# Altium project Custom Phone.PrjPcb (part 2 of 4)

## Sheet Power.SchDoc
size C; SheetNumber: 3; SheetTotal: 9
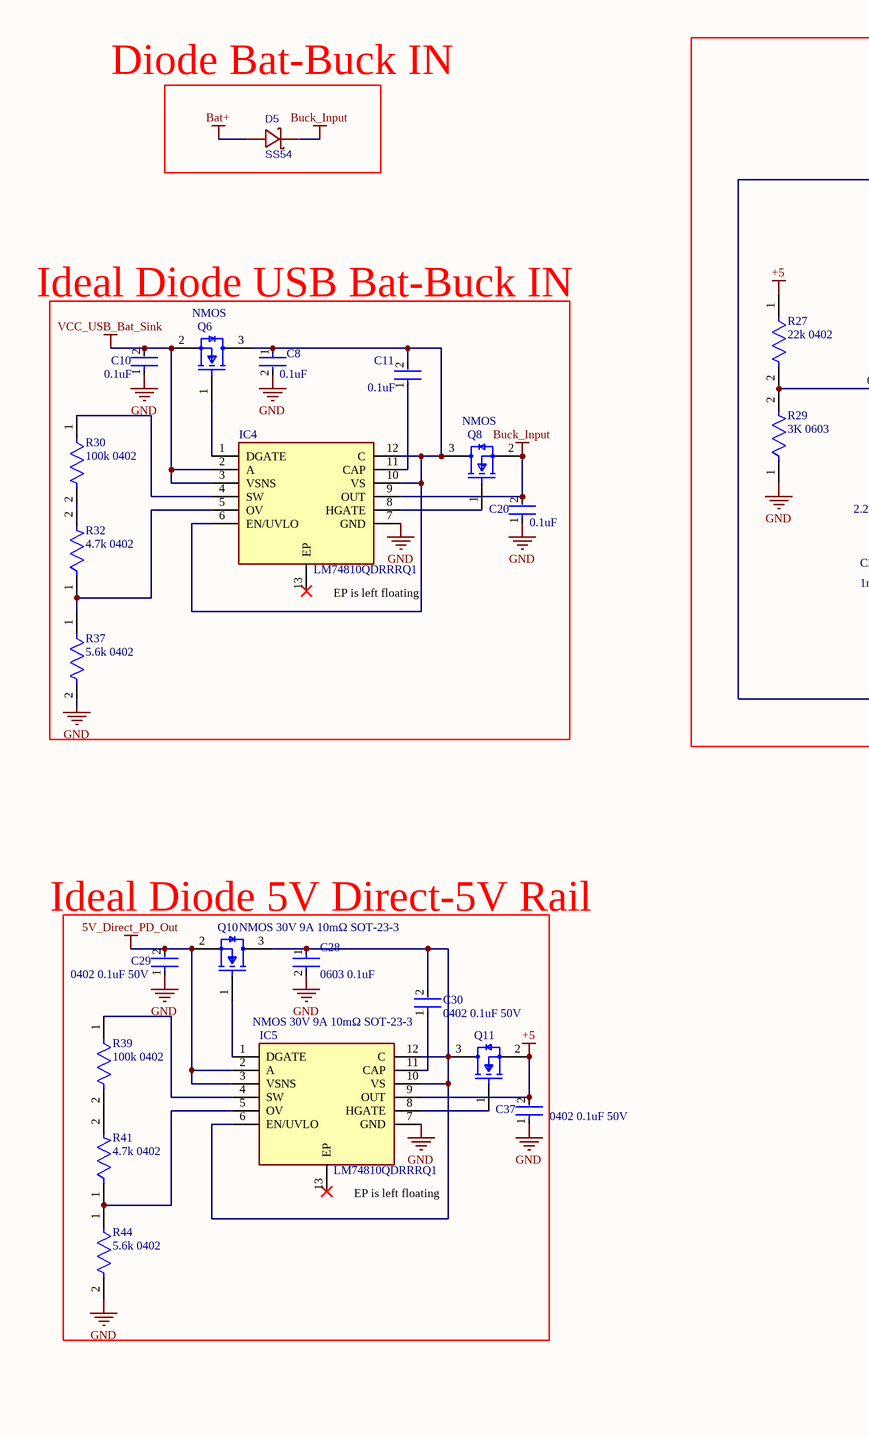
[diagram p5: Power.SchDoc, left]
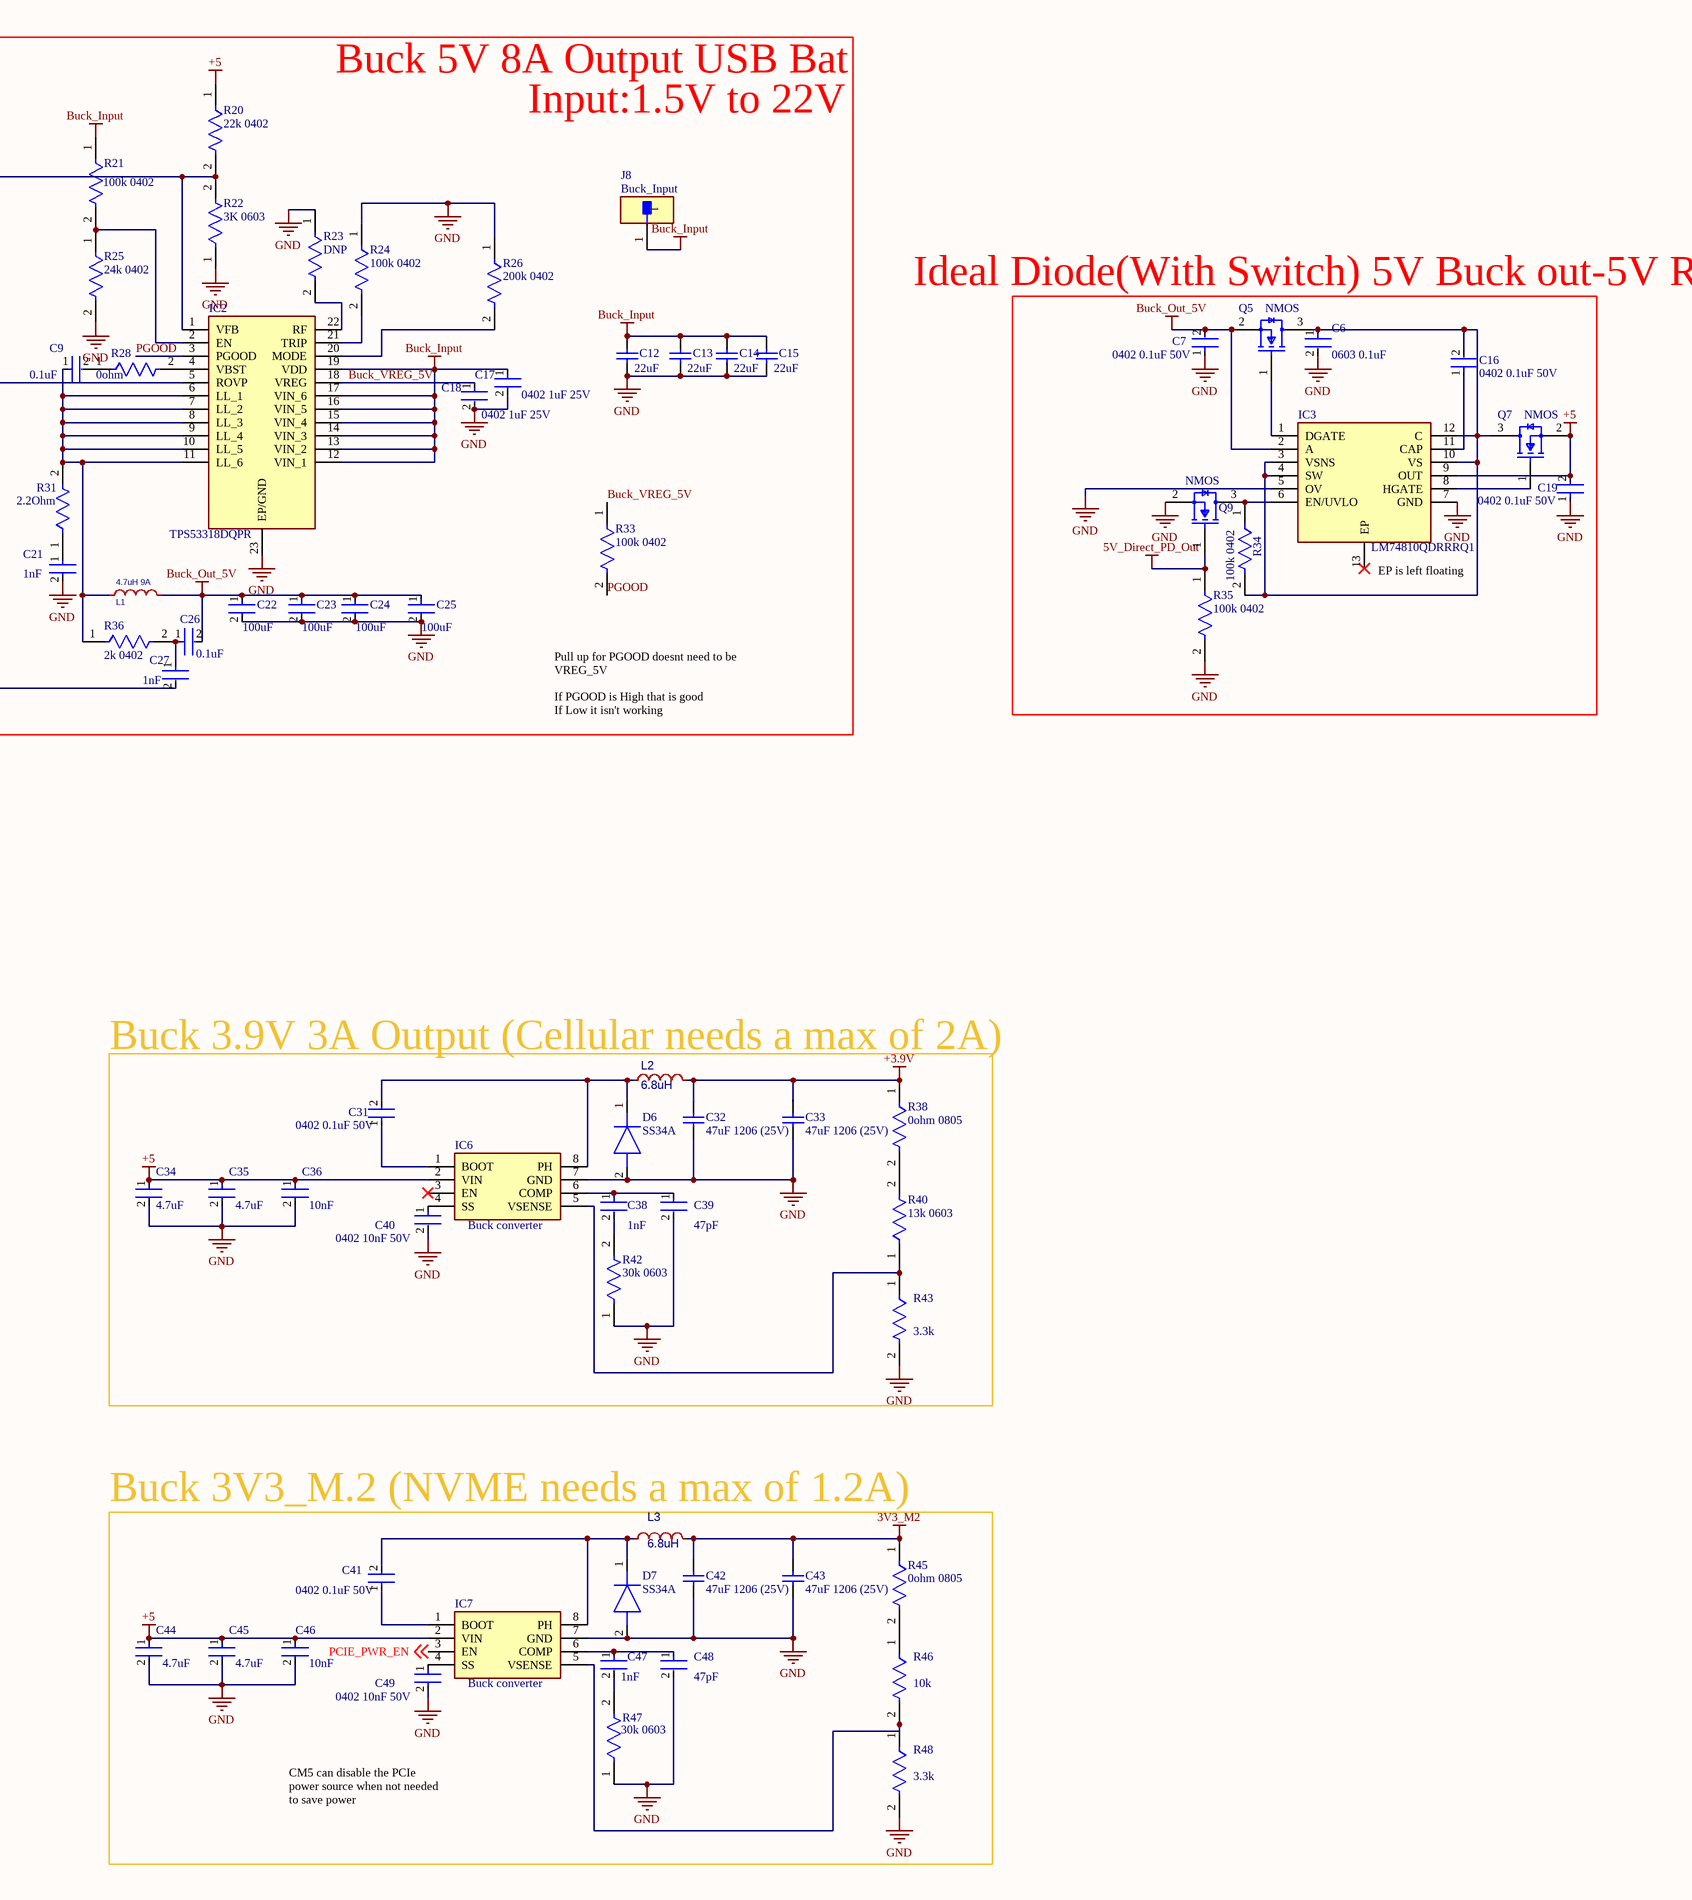
[diagram p6: Power.SchDoc, right]

### Parts
C6  0603 0.1uF  [FP-CC0603-DC-MFG]
C7  0402 0.1uF 50V  [FP-C0402-BB-MFG]
C8  0.1uF  [FP-CC0603-DC-MFG]
C9  0.1uF  [FP-C0402-BB-MFG]
C10  0.1uF  [FP-C0402-BB-MFG]
C11  0.1uF  [FP-C0402-BB-MFG]
C12  22uF  [CAPC2013X94X50LL20T25]
C13  22uF  [CAPC2013X94X50LL20T25]
C14  22uF  [CAPC2013X94X50LL20T25]
C15  22uF  [CAPC2013X94X50LL20T25]
C16  0402 0.1uF 50V  [FP-C0402-BB-MFG]
C17  0402 1uF 25V  [FP-C0402-BB-MFG]
C18  0402 1uF 25V  [FP-C0402-BB-MFG]
C19  0402 0.1uF 50V  [FP-C0402-BB-MFG]
C20  0.1uF  [FP-C0402-BB-MFG]
C21  1nF  [FP-C0402-BB-MFG]
C22  100uF  [FP-CC1210-GD-IPC_A]
C23  100uF  [FP-CC1210-GD-IPC_A]
C24  100uF  [FP-CC1210-GD-IPC_A]
C25  100uF  [FP-CC1210-GD-IPC_A]
C26  0.1uF  [FP-C0402-BB-MFG]
C27  1nF  [FP-C0402-BB-MFG]
C28  0603 0.1uF  [FP-CC0603-DC-MFG]
C29  0402 0.1uF 50V  [FP-C0402-BB-MFG]
C30  0402 0.1uF 50V  [FP-C0402-BB-MFG]
C31  0402 0.1uF 50V  [FP-C0402-BB-MFG]
C32  47uF 1206 (25V)  [CAPC1206(3216)190_N]
C33  47uF 1206 (25V)  [CAPC1206(3216)190_N]
C34  4.7uF  [FP-CC0603-DC-MFG]
C35  4.7uF  [FP-CC0603-DC-MFG]
C36  10nF  [FP-C0402-BB-MFG]
C37  0402 0.1uF 50V  [FP-C0402-BB-MFG]
C38  1nF  [FP-C0402-BB-MFG]
C39  47pF  [FP-C0402-BB-MFG]
C40  0402 10nF 50V  [FP-C0402-BB-MFG]
C41  0402 0.1uF 50V  [FP-C0402-BB-MFG]
C42  47uF 1206 (25V)  [CAPC1206(3216)190_N]
C43  47uF 1206 (25V)  [CAPC1206(3216)190_N]
C44  4.7uF  [FP-CC0603-DC-MFG]
C45  4.7uF  [FP-CC0603-DC-MFG]
C46  10nF  [FP-C0402-BB-MFG]
C47  1nF  [FP-C0402-BB-MFG]
C48  47pF  [FP-C0402-BB-MFG]
C49  0402 10nF 50V  [FP-C0402-BB-MFG]
D5  SS54  [SMB_L4.6-W3.6-LS5.3-RD]
D6  SS34A  [DIOM5026X262N]
D7  SS34A  [DIOM5026X262N]
IC2  TPS53318DQPR  [SON50P500X600X150-23N]
IC3  LM74810QDRRRQ1  [SON50P300X300X80-13N-D]
IC4  LM74810QDRRRQ1  [SON50P300X300X80-13N-D]
IC5  LM74810QDRRRQ1  [SON50P300X300X80-13N-D]
IC6  Buck converter  [SOIC127P600X175-8N]
IC7  Buck converter  [SOIC127P600X175-8N]
J8  Buck_Input  [FP-5015-MFG]
L1  4.7uH 9A  [IND-SMD_L11.5-W10.0_FXL1040]
L2  6.8uH  [IND-SMD_L7.0-W6.6]
L3  6.8uH  [IND-SMD_L7.0-W6.6]
Q5  NMOS  [FP-C04-17458-MFG]
Q6  NMOS  [FP-C04-17458-MFG]
Q7  NMOS  [FP-C04-17458-MFG]
Q8  NMOS  [FP-C04-17458-MFG]
Q9  NMOS  [FP-C04-17458-MFG]
Q10  NMOS 30V 9A 10mΩ SOT-23-3  [FP-C04-17458-MFG]
Q11  NMOS 30V 9A 10mΩ SOT-23-3  [FP-C04-17458-MFG]
R20  22k 0402  [FP-RMCF0402-MFG]
R21  100k 0402  [FP-RMCF0402-MFG]
R22  3K 0603  [FP-RMCF0603-IPC_A]
R23  DNP  [FP-RN73R2A-IPC_C]
R24  100k 0402  [FP-RMCF0402-MFG]
R25  24k 0402  [FP-RMCF0402-MFG]
R26  200k 0402  [FP-RMCF0402-MFG]
R27  22k 0402  [FP-RMCF0402-MFG]
R28  0ohm  [FP-RN73R2A-IPC_C]
R29  3K 0603  [FP-RMCF0603-IPC_A]
R30  100k 0402  [FP-RMCF0402-MFG]
R31  2.2Ohm  [FP-RMCF0603-IPC_A]
R32  4.7k 0402  [FP-RMCF0402-MFG]
R33  100k 0402  [FP-RMCF0402-MFG]
R34  100k 0402  [FP-RMCF0402-MFG]
R35  100k 0402  [FP-RMCF0402-MFG]
R36  2k 0402  [FP-RMCF0402-MFG]
R37  5.6k 0402  [FP-RMCF0402-MFG]
R38  0ohm 0805  [FP-RN73R2A-IPC_C]
R39  100k 0402  [FP-RMCF0402-MFG]
R40  13k 0603  [FP-RMCF0603-MFG]
R41  4.7k 0402  [FP-RMCF0402-MFG]
R42  30k 0603  [FP-RMCF0603-MFG]
R43  3.3k  [FP-RMCF0402-MFG]
R44  5.6k 0402  [FP-RMCF0402-MFG]
R45  0ohm 0805  [FP-RN73R2A-IPC_C]
R46  10k  [FP-RMCF0402-MFG]
R47  30k 0603  [FP-RMCF0603-MFG]
R48  3.3k  [FP-RMCF0402-MFG]

### Blocks framed on the sheet
Buck 3.9V 3A Output (Cellular needs a max of 2A): C31-C36 C38-C40 D6 IC6 L2 R38 R40 R42 R43
Buck 3V3_M.2 (NVME needs a max of 1.2A): C41-C49 D7 IC7 L3 R45-R48

### Nets
3V3_M2: C42.2 C43.2 L3.2 R45.1
5V_Direct_PD_Out: C29.2 IC5.2(A) IC5.3(VSNS) Q9.1(G) Q10.2(S) R35.1
+3.9V: C32.2 C33.2 L2.2 R38.1
+5: C19.2 C34.1 C35.1 C36.1 C37.2 C44.1 C45.1 C46.1 IC3.9(OUT) IC5.9(OUT) IC6.2(VIN) IC7.2(VIN) Q7.2(S) Q11.2(S) R20.1 R27.1
Bat+: D5.2(A)
Buck_Input: C12.1 C13.1 C14.1 C15.1 C17.1 C20.2 D5.1(K) IC2.12(VIN_1) IC2.13(VIN_2) IC2.14(VIN_3) IC2.15(VIN_4) IC2.16(VIN_5) IC2.17(VIN_6) IC2.19(VDD) IC4.9(OUT) J8.1 Q8.2(S) R21.1
Buck_Out_5V: C7.2 C22.1 C23.1 C24.1 C25.1 C26.2 IC3.2(A) L1.2 Q5.2(S)
GND: C6.2 C7.1 C8.2 C10.1 C12.2 C13.2 C14.2 C15.2 C17.2 C18.2 C19.1 C20.1 C21.2 C22.2 C23.2 C24.2 C25.2 C28.2 C29.1 C32.1 C33.1 C34.2 C35.2 C36.2 C37.1 C39.2 C40.2 C42.1 C43.1 C44.2 C45.2 C46.2 C48.2 C49.2 D6.2(A) D7.2(A) IC2.23(EP/GND) IC3.5(OV) IC3.7(GND) IC4.7(GND) IC5.7(GND) IC6.7(GND) IC7.7(GND) Q9.2(S) R22.1 R23.1 R24.1 R25.2 R26.1 R29.1 R35.2 R37.2 R42.1 R43.2 R44.2 R47.1 R48.2
VCC_USB_Bat_Sink: C10.2 IC4.2(A) IC4.3(VSNS) Q6.2(S)
Buck_VREG_5V: C18.1 IC2.18(VREG) R33.1
PCIE_PWR_EN: IC7.3(EN) ; off-sheet PCIE_PWR_EN
PGOOD: IC2.3(PGOOD) R33.2
NetC6_1: C6.1 C16.2 IC3.3(VSNS) IC3.4(SW) IC3.10(VS) IC3.12(C) Q5.3(D) Q7.3(D) R34.2
NetC8_1: C8.1 C11.2 IC4.6(EN/UVLO) IC4.10(VS) IC4.12(C) Q6.3(D) Q8.3(D)
NetC9_1: C9.1 IC2.6(LL_1) IC2.7(LL_2) IC2.8(LL_3) IC2.9(LL_4) IC2.10(LL_5) IC2.11(LL_6) L1.1 R31.2 R36.1
NetC9_2: C9.2 R28.1
NetC11_1: C11.1 IC4.11(CAP)
NetC16_1: C16.1 IC3.11(CAP)
NetC21_1: C21.1 R31.1
NetC26_1: C26.1 C27.1 R36.2
NetC27_2: C27.2 IC2.1(VFB) R20.2 R22.2
NetC28_1: C28.1 C30.2 IC5.6(EN/UVLO) IC5.10(VS) IC5.12(C) Q10.3(D) Q11.3(D)
NetC30_1: C30.1 IC5.11(CAP)
NetC31_1: C31.1 IC6.1(BOOT)
NetC31_2: C31.2 D6.1(K) IC6.8(PH) L2.1
NetC38_1: C38.1 C39.1 IC6.6(COMP)
NetC38_2: C38.2 R42.2
NetC40_1: C40.1 IC6.4(SS)
NetC41_1: C41.1 IC7.1(BOOT)
NetC41_2: C41.2 D7.1(K) IC7.8(PH) L3.1
NetC47_1: C47.1 C48.1 IC7.6(COMP)
NetC47_2: C47.2 R47.2
NetC49_1: C49.1 IC7.4(SS)
NetIC2_2: IC2.2(EN) R21.2 R25.1
NetIC2_4: IC2.4(VBST) R28.2
NetIC2_5: IC2.5(ROVP) R27.2 R29.2
NetIC2_20: IC2.20(MODE) R26.2
NetIC2_21: IC2.21(TRIP) R24.2
NetIC2_22: IC2.22(RF) R23.2
NetIC3_1: IC3.1(DGATE) Q5.1(G)
NetIC3_6: IC3.6(EN/UVLO) Q9.3(D) R34.1
NetIC3_8: IC3.8(HGATE) Q7.1(G)
NetIC4_1: IC4.1(DGATE) Q6.1(G)
NetIC4_4: IC4.4(SW) R30.1
NetIC4_5: IC4.5(OV) R32.1 R37.1
NetIC4_8: IC4.8(HGATE) Q8.1(G)
NetIC5_1: IC5.1(DGATE) Q10.1(G)
NetIC5_4: IC5.4(SW) R39.1
NetIC5_5: IC5.5(OV) R41.1 R44.1
NetIC5_8: IC5.8(HGATE) Q11.1(G)
NetIC6_5: IC6.5(VSENSE) R40.1 R43.1
NetIC7_5: IC7.5(VSENSE) R46.2 R48.1
NetR30_2: R30.2 R32.2
NetR38_2: R38.2 R40.2
NetR39_2: R39.2 R41.2
NetR45_2: R45.2 R46.1

Not connected (* = marked no-connect by the designer): IC3 13(EP)*; IC4 13(EP)*; IC5 13(EP)*; IC6 3(EN)*

### Notes on the sheet
- Diode Bat-Buck IN
- Buck 5V 8A Output USB Bat
- Input:1.5V to 22V
- Ideal Diode USB Bat-Buck IN
- Ideal Diode(With Switch) 5V Buck out-5V Rail
- (near IC4) EP is left floating
- (near IC3) EP is left floating
- Pull up for PGOOD doesnt need to be VREG_5V
  If PGOOD is High that is good
  If Low it isn't working
- Ideal Diode 5V Direct-5V Rail
- (near IC5) EP is left floating
- CM5 can disable the PCIe power source when not needed to save power

### Library data of the parts
C6 C8 C28 = CMP-00621-81932632-1: C14663; Capacitance: 10µF; Voltage Rating: 16V; Dielectric: X5R; Material: Ceramic; Tolerance: 10%; NexarPartId: 81932632; Height: 1mm; Halogen Free: Halogen Free; Max Operating Temperature: 85°C; Voltage Rating (DC): 16V; Lead Free: Lead Free; RoHS: Non-Compliant; Min Operating Temperature: -55°C; Case/Package: 0603
C7 C9-C11 C16 C19 C20 C26 C29-C31 C37 C41 = CMP-03020-014070-2: C307331; Manufacturer: Kemet; Manufacturer Part Number: C0402C104M3PAC7867; Material: Ceramic; Tolerance: 0.2; Temperature Characteristic: X5R; Value: 0.10 μF; Temperature Coefficient: 15%; Voltage Rating: 25 V; Height: 0.55mm; Category: Cap; Temperature: -55°C to +125°C; Automotive: No; Package: C0402-BB; Temperature Range Low: -55°C; ComponentLink2Description: Datasheet; Device Class L3: Ceramic Capacitors; ComponentLink2URL: https://content.kemet.com/datasheets/KEM_C1002_X7R_SMD.pdf; Octopart: https://octopart.com/c0402c104m3pac7867-kemet-84304880; RoHS: TRUE; Temperature Range High: +125°C; Device Class L1: Passive Components; Capacitance: 0.10 μF; Lead Free: Yes; Ipc Land Pattern Name: CAPC10050X50; Device Class L2: Capacitors; Digikey Description: CAP CER 0.1UF 25V X5R 0402
C12-C15 = CMP-2007-04160-1: C45783; Part Number: 08051C102KAT4A; Manufacturer: AVX Interconnect / Elco
C17 C18 = CMP-03020-014070-2: C52923; Manufacturer: Kemet; Manufacturer Part Number: C0402C104M3PAC7867; Material: Ceramic; Tolerance: 0.2; Temperature Characteristic: X5R; Value: 0.10 μF; Temperature Coefficient: 15%; Height: 0.55mm; Category: Cap; Temperature: -55°C to +125°C; Automotive: No; Package: C0402-BB; Temperature Range Low: -55°C; ComponentLink2Description: Datasheet; Device Class L3: Ceramic Capacitors; ComponentLink2URL: https://content.kemet.com/datasheets/KEM_C1002_X7R_SMD.pdf; Octopart: https://octopart.com/c0402c104m3pac7867-kemet-84304880; RoHS: TRUE; Temperature Range High: +125°C; Device Class L1: Passive Components; Capacitance: 0.10 μF; Lead Free: Yes; Voltage Rating: 25 V; Ipc Land Pattern Name: CAPC10050X50; Device Class L2: Capacitors; Digikey Description: CAP CER 0.1UF 25V X5R 0402
C21 C27 C38 C47 = CMP-03020-014070-2: C1523; Manufacturer: Kemet; Manufacturer Part Number: C0402C104M3PAC7867; Material: Ceramic; Tolerance: 0.2; Temperature Characteristic: X5R; Value: 0.10 μF; Temperature Coefficient: 15%; Voltage Rating: 25 V; Height: 0.55mm; Category: Cap; Temperature: -55°C to +125°C; Automotive: No; Package: C0402-BB; Temperature Range Low: -55°C; ComponentLink2Description: Datasheet; Device Class L3: Ceramic Capacitors; ComponentLink2URL: https://content.kemet.com/datasheets/KEM_C1002_X7R_SMD.pdf; Octopart: https://octopart.com/c0402c104m3pac7867-kemet-84304880; RoHS: TRUE; Temperature Range High: +125°C; Device Class L1: Passive Components; Capacitance: 0.10 μF; Lead Free: Yes; Ipc Land Pattern Name: CAPC10050X50; Device Class L2: Capacitors; Digikey Description: CAP CER 0.1UF 25V X5R 0402
C22-C25 = CMP-03422-001480-1: C7432790; Capacitance: 220uF; Tolerance: 20%; Voltage Rating: 6.3V; Max Operating Temperature: 85°C; Mount: Surface Mount; RoHS Compliant: Yes; Packaging: Tape and Reel; Case/Package: 1210; Min Operating Temperature: -55°C
C32 C33 C42 C43 = CMP-1037-05002-1: C6119973; Case-Metric: 3216; Case-EIA: 1206; Tolerance: Â±20%; Rated Voltage: 10 V; Technology: SMT; Value: 47uF; Max Thickness: 1.9 mm
C34 C35 C44 C45 = CMP-00621-81932632-1: C19666; Capacitance: 10µF; Voltage Rating: 16V; Dielectric: X5R; Material: Ceramic; Tolerance: 10%; NexarPartId: 81932632; Height: 1mm; Halogen Free: Halogen Free; Max Operating Temperature: 85°C; Voltage Rating (DC): 16V; Lead Free: Lead Free; RoHS: Non-Compliant; Min Operating Temperature: -55°C; Case/Package: 0603
C36 C40 C46 C49 = CMP-03020-014070-2: C15195; Manufacturer: Kemet; Manufacturer Part Number: C0402C104M3PAC7867; Material: Ceramic; Tolerance: 0.2; Temperature Characteristic: X5R; Value: 0.10 μF; Temperature Coefficient: 15%; Voltage Rating: 25 V; Height: 0.55mm; Category: Cap; Temperature: -55°C to +125°C; Automotive: No; Package: C0402-BB; Temperature Range Low: -55°C; ComponentLink2Description: Datasheet; Device Class L3: Ceramic Capacitors; ComponentLink2URL: https://content.kemet.com/datasheets/KEM_C1002_X7R_SMD.pdf; Octopart: https://octopart.com/c0402c104m3pac7867-kemet-84304880; RoHS: TRUE; Temperature Range High: +125°C; Device Class L1: Passive Components; Capacitance: 0.10 μF; Lead Free: Yes; Ipc Land Pattern Name: CAPC10050X50; Device Class L2: Capacitors; Digikey Description: CAP CER 0.1UF 25V X5R 0402
C39 C48 = CMP-03020-014070-2: C1567; Manufacturer: Kemet; Manufacturer Part Number: C0402C104M3PAC7867; Material: Ceramic; Tolerance: 0.2; Temperature Characteristic: X5R; Value: 0.10 μF; Temperature Coefficient: 15%; Voltage Rating: 25 V; Height: 0.55mm; Category: Cap; Temperature: -55°C to +125°C; Automotive: No; Package: C0402-BB; Temperature Range Low: -55°C; ComponentLink2Description: Datasheet; Device Class L3: Ceramic Capacitors; ComponentLink2URL: https://content.kemet.com/datasheets/KEM_C1002_X7R_SMD.pdf; Octopart: https://octopart.com/c0402c104m3pac7867-kemet-84304880; RoHS: TRUE; Temperature Range High: +125°C; Device Class L1: Passive Components; Capacitance: 0.10 μF; Lead Free: Yes; Ipc Land Pattern Name: CAPC10050X50; Device Class L2: Capacitors; Digikey Description: CAP CER 0.1UF 25V X5R 0402
D5 = SS54: C32513; Manufacturer Part: SS54B; Manufacturer: MDD(辰达半导体); Supplier: LCSC; Supplier Part: C32513; JLCPCB Part Class: Extended Part; spicePre: D; spiceSymbolName: SS54
D6 D7 = SS34A: C8678; Manufacturer_Name: HY Electronic; Datasheet Link: https://datasheet.datasheetarchive.com/originals/distributors/Datasheets-3/DSA-43252.pdf; Height: 2.62mm; Manufacturer_Part_Number: SS34A
IC2 = TPS53318DQPR: C179745; Manufacturer_Name: Texas Instruments; Datasheet Link: http://www.ti.com/lit/gpn/TPS53318; Height: 1.5mm; Manufacturer_Part_Number: TPS53318DQPR; Mouser Part Number: 595-TPS53318DQPR; Mouser Price/Stock: https://www.mouser.co.uk/ProductDetail/Texas-Instruments/TPS53318DQPR?qs=4whTb%2F0XQMghW0Cmq9uGjw%3D%3D; Arrow Part Number: TPS53318DQPR; Arrow Price/Stock: https://www.arrow.com/en/products/tps53318dqpr/texas-instruments.html?utm_currency=USD&region=nac
IC3-IC5 = LM74810QDRRRQ1: C3215601; Manufacturer_Name: Texas Instruments; Datasheet Link: https://www.ti.com/lit/ds/symlink/lm7481-q1.pdf?ts=1623392902286&ref_url=https%253A%252F%252Fwww.ti.com%252Fproduct%252FLM7481-Q1%253FkeyMatch%253DLM74810QDRRRQ1%2526tisearch%253Dsearch-everything%2526usecase%253DOPN; Height: 0.8mm; Manufacturer_Part_Number: LM74810QDRRRQ1; Mouser Part Number: 595-LM74810QDRRRQ1; Mouser Price/Stock: https://www.mouser.co.uk/ProductDetail/Texas-Instruments/LM74810QDRRRQ1?qs=KUoIvG%2F9IlZgYO4cz5Fhzw%3D%3D; Arrow Part Number: LM74810QDRRRQ1; Arrow Price/Stock: null?region=nac
IC6 IC7 = TPS54331D: C9865; Manufacturer_Name: Texas Instruments; Datasheet Link: http://www.ti.com/lit/gpn/tps54331; Height: 1.75mm; Manufacturer_Part_Number: TPS54331D; Mouser Part Number: 595-TPS54331D; Mouser Price/Stock: https://www.mouser.co.uk/ProductDetail/Texas-Instruments/TPS54331D?qs=QyYHynRG50pEbpiybdzwkw%3D%3D; Arrow Part Number: TPS54331D; Arrow Price/Stock: https://www.arrow.com/en/products/tps54331d/texas-instruments?utm_currency=USD&region=europe
J8 = CMP-2000-05183-2: PC TEST POINT MINIATURE; Manufacturer Part Number: 5015; Manufacturer: keystone; Number Of Contacts: 1; Conn Orientation: Straight; Category: Conn; Digikey Description: PC TEST POINT MINIATURE; Automotive: No; Lead Free: Yes; Octopart: https://octopart.com/5015-keystone-3822; ComponentLink2URL: http://www.keyelco.com/product-pdf.cfm?p=1353; Package: 5015; RoHS: TRUE; Device Class L3: unset; Device Class L2: unset; Contact Material: Silver; Device Class L1: Connectors; Height: 1.65mm; ComponentLink2Description: Datasheet
L1 = XR1040-4R7M: C5307657; Manufacturer: XR(祥如); Add into BOM: yes; Tolerance: ±20%; Current - Saturation(Isat): 13A; Type: Molded Inductor; Symbol: XR1040-4R7M; Device: XR1040-4R7M; LCSC Part Name: 4.7uH ±20% 13A; Supplier Part: C5307657; Manufacturer Part: XR1040-4R7M; Supplier Footprint: SMD,11.5x10mm; JLCPCB Part Class: Extended Part; Datasheet: https://item.szlcsc.com/datasheet/XR1040-4R7M/6060983.html; Supplier: LCSC; Convert to PCB: yes; Value: 4.7uH; Current Rating: 9A
L2 L3 = FXL0630-6R8-M: C167221; Manufacturer: cjiang(长江微电); Add into BOM: yes; Tolerance: ±20%; Current Rating: 5A; Current - Saturation(Isat): 6A; DC Resistance(DCR): 48mΩ; Type: Molded Inductor; Symbol: FXL0630-6R8-M; Device: FXL0630-6R8-M; LCSC Part Name: 6.8uH ±20% 6A; Supplier Part: C167221; Manufacturer Part: FXL0630-6R8-M; Supplier Footprint: SMD,7x6.6mm; JLCPCB Part Class: Extended Part; Datasheet: https://item.szlcsc.com/datasheet/FXL0630-6R8-M/178604.html; Supplier: LCSC; Convert to PCB: yes; Value: 6.8uH
Q5-Q11 = CMP-00252-47153607-1: C42374608; Gate to Source Voltage (Vgs): 20V; Drain to Source Resistance: 25Ω; Element Configuration: Single; Number of Channels: 1; Drain to Source Voltage (Vdss): 300V; Fall Time: 7ns; Turn-On Delay Time: 10ns; Turn-Off Delay Time: 12ns; Input Capacitance: 50pF; Power Dissipation: 360mW; Continuous Drain Current (ID): 85mA; Weight: 1.437803g; Rds On Max: 25Ω; Case/Package: SOT-23; Min Operating Temperature: -55°C; Length: 2.9mm; RoHS: Compliant; Lifecycle Status: Production; Height: 950µm; NexarPartId: 47153607; Rise Time: 7ns; Lead Free: Lead Free; Width: 1.3mm; Mount: Surface Mount; Number of Pins: 3; Drain to Source Breakdown Voltage: 300V; Radiation Hardening: No; Max Operating Temperature: 150°C; Number of Elements: 1; Max Power Dissipation: 360mW; Schedule B: 8541210080, 8541210080
R20 R27 = CMP-26527-002093-1: C25768; Max Power Dissipation: 63mW; Tolerance: 5%; Resistance: 3.9R; Temperature Coefficient: 200ppm/°C; Case/Package: 0402; Number of Terminations: 2; Min Operating Temperature: -55°C; Height: 0.016inch; Packaging: Tape and Reel; Resistor Type: Thick Film; Length: 0.039inch; Mount: Surface Mount; Series: RMCF; Max Operating Temperature: 155°C; Contact Plating: Tin; Features: Automotive AEC-Q200; Width: 0.02inch; Radiation Hardening: No; RoHS Compliant: Yes
R21 R24 R30 R33-R35 R39 = CMP-26527-002093-1: C25741; Max Power Dissipation: 63mW; Tolerance: 5%; Resistance: 3.9R; Temperature Coefficient: 200ppm/°C; Case/Package: 0402; Number of Terminations: 2; Min Operating Temperature: -55°C; Height: 0.016inch; Packaging: Tape and Reel; Resistor Type: Thick Film; Length: 0.039inch; Mount: Surface Mount; Series: RMCF; Max Operating Temperature: 155°C; Contact Plating: Tin; Features: Automotive AEC-Q200; Width: 0.02inch; Radiation Hardening: No; RoHS Compliant: Yes
R22 R29 = CMP-26527-005729-1: C4211; Tolerance: 1%; Temperature Coefficient: 100ppm/°C; Max Power Dissipation: 100mW; Resistance: 1.02kR; Mount: Surface Mount; Max Operating Temperature: 155°C; Number of Terminations: 2; Radiation Hardening: No; Series: RMCF; Resistor Type: Thick Film; Min Operating Temperature: -55°C; Case/Package: 0603; Packaging: Tape and Reel; Features: Automotive AEC-Q200; Contact Plating: Tin; Length: 0.061inch; RoHS Compliant: Yes; Width: 0.031inch; Height: 0.022inch
R23 = CMP-04015-014497-1: DNP 0805
R25 = CMP-26527-002093-1: C54530790; Max Power Dissipation: 63mW; Tolerance: 5%; Resistance: 3.9R; Temperature Coefficient: 200ppm/°C; Case/Package: 0402; Number of Terminations: 2; Min Operating Temperature: -55°C; Height: 0.016inch; Packaging: Tape and Reel; Resistor Type: Thick Film; Length: 0.039inch; Mount: Surface Mount; Series: RMCF; Max Operating Temperature: 155°C; Contact Plating: Tin; Features: Automotive AEC-Q200; Width: 0.02inch; Radiation Hardening: No; RoHS Compliant: Yes
R26 = CMP-26527-002093-1: C25764; Max Power Dissipation: 63mW; Tolerance: 5%; Resistance: 3.9R; Temperature Coefficient: 200ppm/°C; Case/Package: 0402; Number of Terminations: 2; Min Operating Temperature: -55°C; Height: 0.016inch; Packaging: Tape and Reel; Resistor Type: Thick Film; Length: 0.039inch; Mount: Surface Mount; Series: RMCF; Max Operating Temperature: 155°C; Contact Plating: Tin; Features: Automotive AEC-Q200; Width: 0.02inch; Radiation Hardening: No; RoHS Compliant: Yes
R28 R38 R45 = CMP-04015-014497-1: C17477
R31 = CMP-26527-005729-1: C22939; Tolerance: 1%; Temperature Coefficient: 100ppm/°C; Max Power Dissipation: 100mW; Resistance: 1.02kR; Mount: Surface Mount; Max Operating Temperature: 155°C; Number of Terminations: 2; Radiation Hardening: No; Series: RMCF; Resistor Type: Thick Film; Min Operating Temperature: -55°C; Case/Package: 0603; Packaging: Tape and Reel; Features: Automotive AEC-Q200; Contact Plating: Tin; Length: 0.061inch; RoHS Compliant: Yes; Width: 0.031inch; Height: 0.022inch
R32 R41 = CMP-26527-002093-1: C25900; Max Power Dissipation: 63mW; Tolerance: 5%; Resistance: 3.9R; Temperature Coefficient: 200ppm/°C; Case/Package: 0402; Number of Terminations: 2; Min Operating Temperature: -55°C; Height: 0.016inch; Packaging: Tape and Reel; Resistor Type: Thick Film; Length: 0.039inch; Mount: Surface Mount; Series: RMCF; Max Operating Temperature: 155°C; Contact Plating: Tin; Features: Automotive AEC-Q200; Width: 0.02inch; Radiation Hardening: No; RoHS Compliant: Yes
R36 = CMP-26527-002093-1: C4109; Max Power Dissipation: 63mW; Tolerance: 5%; Resistance: 3.9R; Temperature Coefficient: 200ppm/°C; Case/Package: 0402; Number of Terminations: 2; Min Operating Temperature: -55°C; Height: 0.016inch; Packaging: Tape and Reel; Resistor Type: Thick Film; Length: 0.039inch; Mount: Surface Mount; Series: RMCF; Max Operating Temperature: 155°C; Contact Plating: Tin; Features: Automotive AEC-Q200; Width: 0.02inch; Radiation Hardening: No; RoHS Compliant: Yes
R37 R44 = CMP-26527-002093-1: C25908; Max Power Dissipation: 63mW; Tolerance: 5%; Resistance: 3.9R; Temperature Coefficient: 200ppm/°C; Case/Package: 0402; Number of Terminations: 2; Min Operating Temperature: -55°C; Height: 0.016inch; Packaging: Tape and Reel; Resistor Type: Thick Film; Length: 0.039inch; Mount: Surface Mount; Series: RMCF; Max Operating Temperature: 155°C; Contact Plating: Tin; Features: Automotive AEC-Q200; Width: 0.02inch; Radiation Hardening: No; RoHS Compliant: Yes
R40 = CMP-26527-004332-1: C22797; Tolerance: 1%; Resistance: 2.21kR; Max Power Dissipation: 100mW; Temperature Coefficient: 100ppm/°C; Features: Automotive AEC-Q200; Contact Plating: Tin; Min Operating Temperature: -55°C; Width: 0.031inch; Max Operating Temperature: 155°C; Mount: Surface Mount; Length: 0.061inch; Case/Package: 0603; Resistor Type: Thick Film; Series: RMCF; Packaging: Tape and Reel; Number of Terminations: 2; Height: 0.022inch; RoHS Compliant: Yes; Radiation Hardening: No
R42 R47 = CMP-26527-004332-1: C22984; Tolerance: 1%; Resistance: 2.21kR; Max Power Dissipation: 100mW; Temperature Coefficient: 100ppm/°C; Features: Automotive AEC-Q200; Contact Plating: Tin; Min Operating Temperature: -55°C; Width: 0.031inch; Max Operating Temperature: 155°C; Mount: Surface Mount; Length: 0.061inch; Case/Package: 0603; Resistor Type: Thick Film; Series: RMCF; Packaging: Tape and Reel; Number of Terminations: 2; Height: 0.022inch; RoHS Compliant: Yes; Radiation Hardening: No
R43 R48 = CMP-26527-002093-1: C25890; Max Power Dissipation: 63mW; Tolerance: 5%; Resistance: 3.9R; Temperature Coefficient: 200ppm/°C; Case/Package: 0402; Number of Terminations: 2; Min Operating Temperature: -55°C; Height: 0.016inch; Packaging: Tape and Reel; Resistor Type: Thick Film; Length: 0.039inch; Mount: Surface Mount; Series: RMCF; Max Operating Temperature: 155°C; Contact Plating: Tin; Features: Automotive AEC-Q200; Width: 0.02inch; Radiation Hardening: No; RoHS Compliant: Yes
R46 = CMP-26527-002093-1: C25744; Max Power Dissipation: 63mW; Tolerance: 5%; Resistance: 3.9R; Temperature Coefficient: 200ppm/°C; Case/Package: 0402; Number of Terminations: 2; Min Operating Temperature: -55°C; Height: 0.016inch; Packaging: Tape and Reel; Resistor Type: Thick Film; Length: 0.039inch; Mount: Surface Mount; Series: RMCF; Max Operating Temperature: 155°C; Contact Plating: Tin; Features: Automotive AEC-Q200; Width: 0.02inch; Radiation Hardening: No; RoHS Compliant: Yes

## Sheet Battery Management and Charging.SchDoc
size B; SheetNumber: 4; SheetTotal: 9
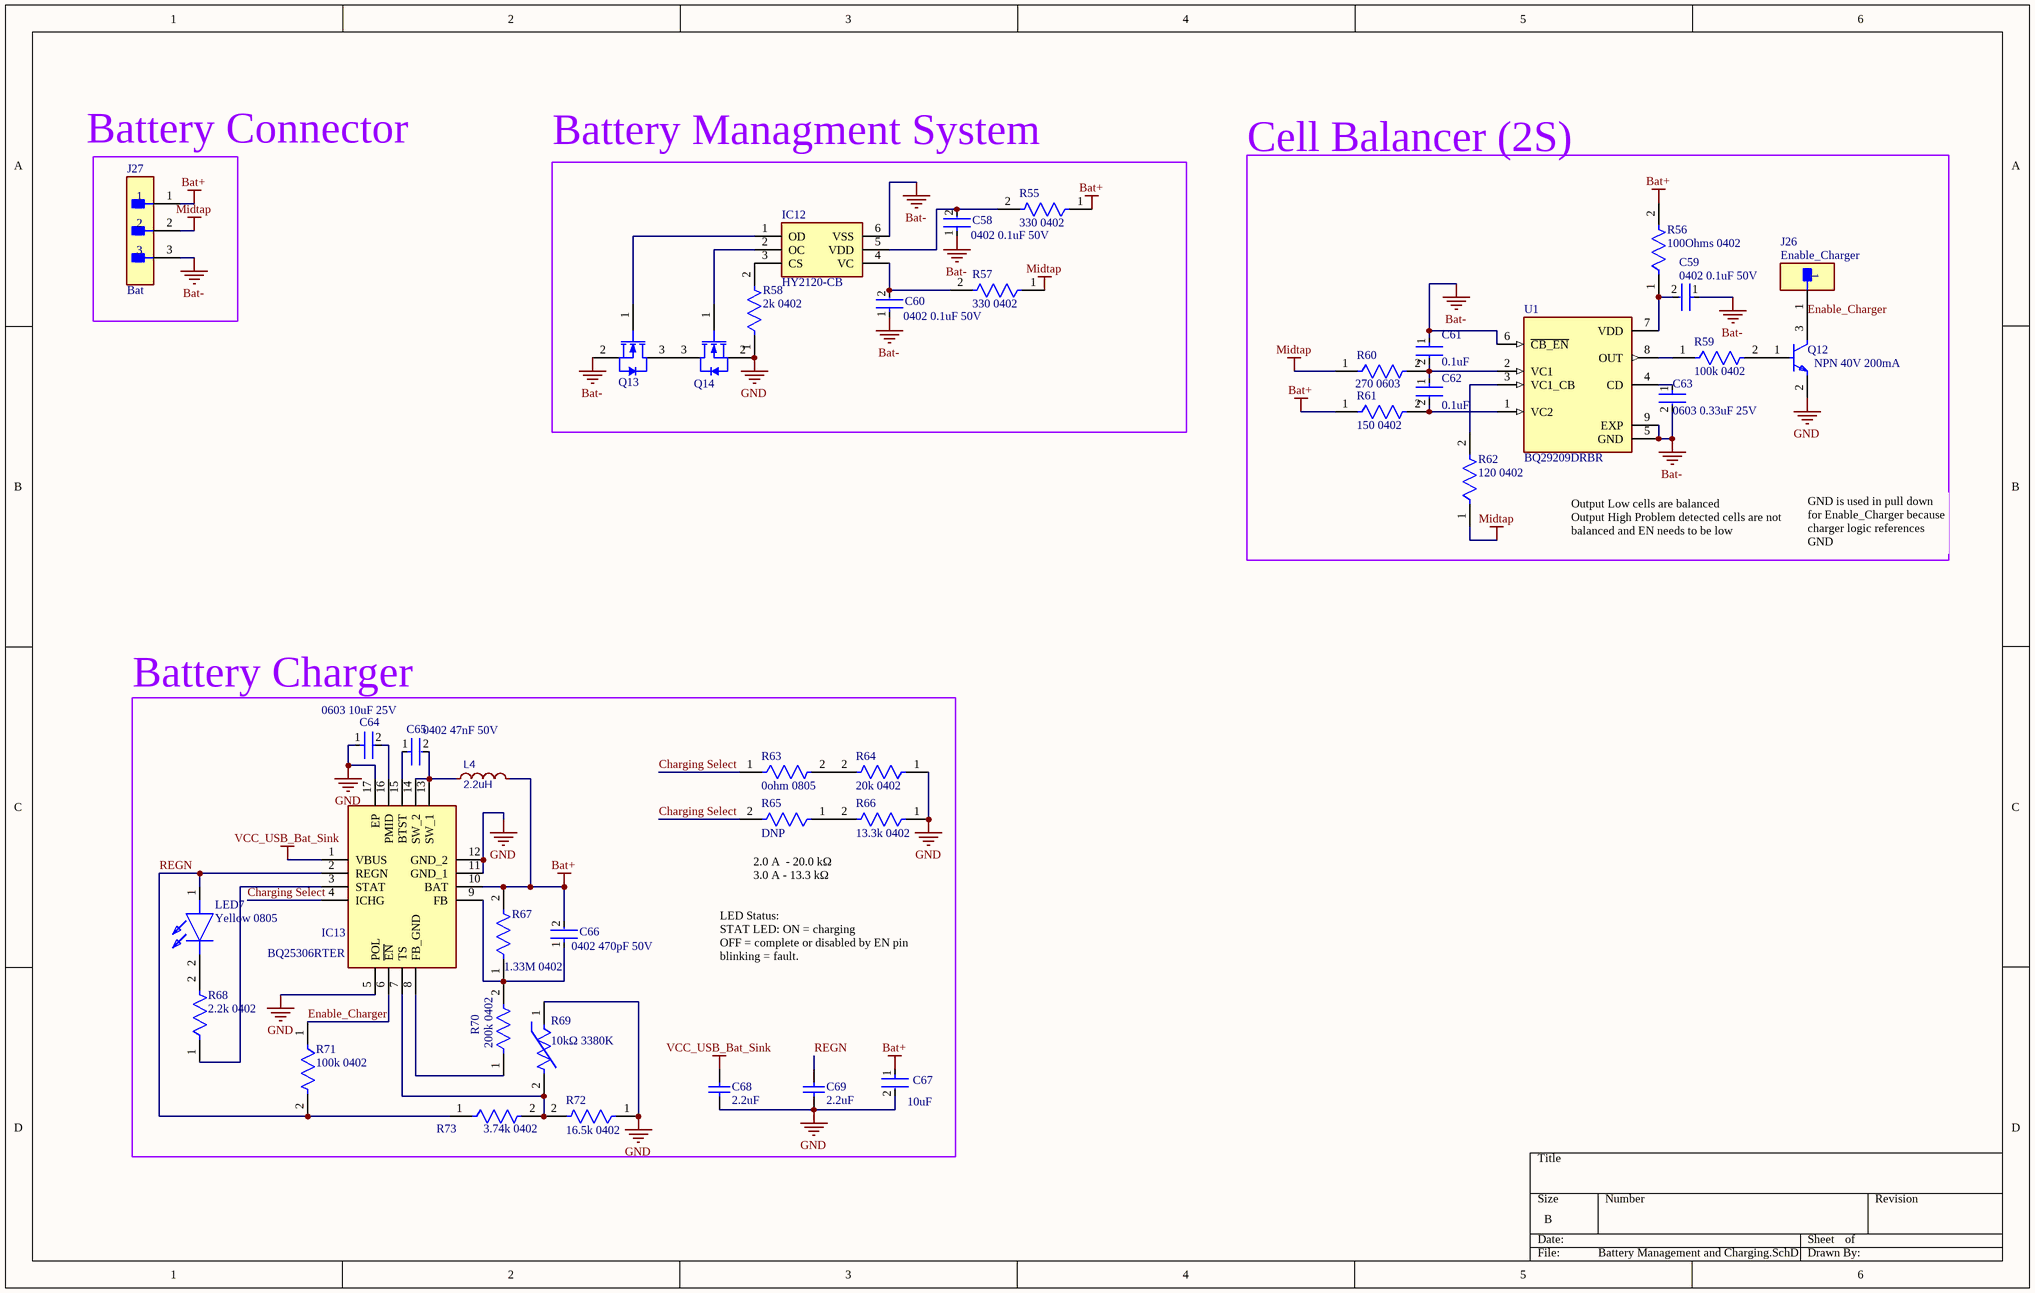
[diagram p7: Battery Management and Charging.SchDoc]

### Parts
C58  0402 0.1uF 50V  [FP-C0402-BB-MFG]
C59  0402 0.1uF 50V  [FP-C0402-BB-MFG]
C60  0402 0.1uF 50V  [FP-C0402-BB-MFG]
C61  0.1uF  [FP-C0402-BB-MFG]
C62  0.1uF  [FP-C0402-BB-MFG]
C63  0603 0.33uF 25V  [FP-CC0603-DC-MFG]
C64  0603 10uF 25V  [FP-CC0603-DC-MFG]
C65  0402 47nF 50V  [FP-C0402-BB-MFG]
C66  0402 470pF 50V  [FP-C0402-BB-MFG]
C67  10uF  [FP-CC0603-DC-MFG]
C68  2.2uF  [CAPC2013X94X50LL20T25]
C69  2.2uF  [CAPC2013X94X50LL20T25]
IC12  HY2120-CB  [SOT95P280X140-6N]
IC13  BQ25306RTER  [QFN50P300X300X80-17N-D]
J26  Enable_Charger  [FP-5015-MFG]
J27  Bat  [FP-TSW-103-14-G-S-MFG]
L4  2.2uH  [2.2uH]
LED7  Yellow 0805  [KT0805G]
Q12  NPN 40V 200mA  [FP-SOT23-IPC_A]
Q13  Discharge Protection  [ONSC-SOT-23-3-318-08_V]  (value not drawn)
Q14  Discharge Protection  [ONSC-SOT-23-3-318-08_V]  (value not drawn)
R55  330 0402  [FP-RMCF0402-MFG]
R56  100Ohms 0402  [FP-RMCF0402-MFG]
R57  330 0402  [FP-RMCF0402-MFG]
R58  2k 0402  [FP-RMCF0402-MFG]
R59  100k 0402  [FP-RMCF0402-MFG]
R60  270 0603  [FP-AC0603-MFG]
R61  150 0402  [FP-RMCF0402-MFG]
R62  120 0402  [FP-RMCF0402-MFG]
R63  0ohm 0805  [FP-RN73R2A-IPC_C]
R64  20k 0402  [FP-RMCF0402-MFG]
R65  DNP  [FP-RN73R2A-IPC_C]
R66  13.3k 0402  [FP-RMCF0402-MFG]
R67  1.33M 0402  [FP-RMCF0402-MFG]
R68  2.2k 0402  [FP-AF0402-IPC_B]
R69  10kΩ 3380K  [FP-NCP15-NCU15-0_05-IPC_A]
R70  200k 0402  [FP-RMCF0402-MFG]
R71  100k 0402  [FP-RMCF0402-MFG]
R72  16.5k 0402  [FP-RMCF0402-MFG]
R73  3.74k 0402  [FP-RMCF0402-MFG]
U1  BQ29209DRBR  [Cell Balancer]

### Blocks framed on the sheet
Battery Managment System: C58 C60 IC12 Q13 Q14 R55 R57 R58
Cell Balancer (2S): C59 C61-C63 J26 Q12 R56 R59-R62 U1
Battery Charger: C64-C69 IC13 L4 LED7 R63-R73

### Nets
Bat+: C66.2 C67.1 IC13.10(BAT) J27.1 L4.2 R55.1 R56.2 R61.1 R67.2
Bat-: C58.1 C59.1 C60.1 C61.1 C63.2 IC12.6(VSS) J27.3 Q13.2(S) U1.5(GND) U1.6(~{CB_EN}) U1.9(EXP)
GND: C64.1 C67.2 C68.1 C69.1 IC13.5(POL) IC13.11(GND_1) IC13.12(GND_2) IC13.17(EP) Q12.2(E) Q14.2(S) R58.1 R64.1 R66.1 R69.1 R72.1
Midtap: J27.2 R57.1 R60.1 R62.1
VCC_USB_Bat_Sink: C68.2 IC13.1(VBUS)
Charging Select: IC13.4(ICHG) R63.1 R65.2
Enable_Charger: IC13.6(~{EN}) J26.1 Q12.3(C) R71.1
REGN: C69.2 IC13.2(REGN) LED7.1(A) R71.2 R73.1
NetC58_2: C58.2 IC12.5(VDD) R55.2
NetC59_2: C59.2 R56.1 U1.7(VDD)
NetC60_2: C60.2 IC12.4(VC) R57.2
NetC61_2: C61.2 C62.1 R60.2 U1.2(VC1)
NetC62_2: C62.2 R61.2 U1.1(VC2)
NetC63_1: C63.1 U1.4(CD)
NetC64_2: C64.2 IC13.16(PMID)
NetC65_1: C65.1 IC13.15(BTST)
NetC65_2: C65.2 IC13.13(SW_1) IC13.14(SW_2) L4.1
NetC66_1: C66.1 IC13.9(FB) R67.1 R70.2
NetIC12_1: IC12.1(OD) Q13.1(G)
NetIC12_2: IC12.2(OC) Q14.1(G)
NetIC12_3: IC12.3(CS) R58.2
NetIC13_3: IC13.3(STAT) R68.1
NetIC13_7: IC13.7(TS) R69.2 R72.2 R73.2
NetIC13_8: IC13.8(FB_GND) R70.1
NetLED7_2: LED7.2(K) R68.2
NetQ12_1: Q12.1(B) R59.2
NetQ13_3: Q13.3(D) Q14.3(D)
NetR59_1: R59.1 U1.8(OUT)
NetR62_2: R62.2 U1.3(VC1_CB)
NetR63_2: R63.2 R64.2
NetR65_1: R65.1 R66.2

### Notes on the sheet
- (near J27) Battery Connector
- Output Low cells are balanced
  Output High Problem detected cells are not balanced and EN needs to be low
- GND is used in pull down for Enable_Charger because charger logic references GND
- 2.0 A  - 20.0 kΩ
  3.0 A - 13.3 kΩ
- LED Status:
  STAT LED: ON = charging
  OFF = complete or disabled by EN pin
  blinking = fault.

### Library data of the parts
C58-C62 = CMP-03020-014070-2: as C7 on sheet Power; Height: 0.55mm; Category: Cap; Temperature: -55°C to +125°C; Automotive: No; Package: C0402-BB; Temperature Range Low: -55°C; ComponentLink2Description: Datasheet; Device Class L3: Ceramic Capacitors; ComponentLink2URL: https://content.kemet.com/datasheets/KEM_C1002_X7R_SMD.pdf; Octopart: https://octopart.com/c0402c104m3pac7867-kemet-84304880; RoHS: TRUE; Temperature Range High: +125°C; Device Class L1: Passive Components; Capacitance: 0.10 μF; Lead Free: Yes; Ipc Land Pattern Name: CAPC10050X50; Device Class L2: Capacitors; Digikey Description: CAP CER 0.1UF 25V X5R 0402
C63 = CMP-00621-81932632-1: C1615; Capacitance: 10µF; Voltage Rating: 16V; Dielectric: X5R; Material: Ceramic; Tolerance: 10%; NexarPartId: 81932632; Height: 1mm; Halogen Free: Halogen Free; Max Operating Temperature: 85°C; Voltage Rating (DC): 16V; Lead Free: Lead Free; RoHS: Non-Compliant; Min Operating Temperature: -55°C; Case/Package: 0603
C64 C67 = CMP-00621-81932632-1: C96446; Capacitance: 10µF; Voltage Rating: 16V; Dielectric: X5R; Material: Ceramic; Tolerance: 10%; NexarPartId: 81932632; Height: 1mm; Halogen Free: Halogen Free; Max Operating Temperature: 85°C; Voltage Rating (DC): 16V; Lead Free: Lead Free; RoHS: Non-Compliant; Min Operating Temperature: -55°C; Case/Package: 0603
C65 = CMP-03020-014070-2: C7393874; Manufacturer: Kemet; Manufacturer Part Number: C0402C104M3PAC7867; Material: Ceramic; Tolerance: 0.2; Temperature Characteristic: X5R; Value: 0.10 μF; Temperature Coefficient: 15%; Voltage Rating: 25 V; Height: 0.55mm; Category: Cap; Temperature: -55°C to +125°C; Automotive: No; Package: C0402-BB; Temperature Range Low: -55°C; ComponentLink2Description: Datasheet; Device Class L3: Ceramic Capacitors; ComponentLink2URL: https://content.kemet.com/datasheets/KEM_C1002_X7R_SMD.pdf; Octopart: https://octopart.com/c0402c104m3pac7867-kemet-84304880; RoHS: TRUE; Temperature Range High: +125°C; Device Class L1: Passive Components; Capacitance: 0.10 μF; Lead Free: Yes; Ipc Land Pattern Name: CAPC10050X50; Device Class L2: Capacitors; Digikey Description: CAP CER 0.1UF 25V X5R 0402
C66 = CMP-03020-014070-2: C1537; Manufacturer: Kemet; Manufacturer Part Number: C0402C104M3PAC7867; Material: Ceramic; Tolerance: 0.2; Temperature Characteristic: X5R; Value: 0.10 μF; Temperature Coefficient: 15%; Voltage Rating: 25 V; Height: 0.55mm; Category: Cap; Temperature: -55°C to +125°C; Automotive: No; Package: C0402-BB; Temperature Range Low: -55°C; ComponentLink2Description: Datasheet; Device Class L3: Ceramic Capacitors; ComponentLink2URL: https://content.kemet.com/datasheets/KEM_C1002_X7R_SMD.pdf; Octopart: https://octopart.com/c0402c104m3pac7867-kemet-84304880; RoHS: TRUE; Temperature Range High: +125°C; Device Class L1: Passive Components; Capacitance: 0.10 μF; Lead Free: Yes; Ipc Land Pattern Name: CAPC10050X50; Device Class L2: Capacitors; Digikey Description: CAP CER 0.1UF 25V X5R 0402
C68 C69 = CMP-2007-04160-1: C377773; Part Number: 08051C102KAT4A; Manufacturer: AVX Interconnect / Elco
IC12 = HY2120-CB: C116509; Manufacturer_Name: Hycon; Datasheet Link: https://datasheet.lcsc.com/szlcsc/HYCON-Tech-HY2120CB_C116509.pdf; Height: 1.4mm; Manufacturer_Part_Number: HY2120-CB
IC13 = BQ25306RTER: C3682611; Manufacturer_Name: Texas Instruments; Datasheet Link: https://datasheet.datasheetarchive.com/originals/distributors/Datasheets_SAMA/2f547f963ca1fcc8a9da6a9d70991dab.pdf; Height: 0.8mm; Manufacturer_Part_Number: BQ25306RTER; Mouser Part Number: 595-BQ25306RTER; Mouser Price/Stock: https://www.mouser.co.uk/ProductDetail/Texas-Instruments/BQ25306RTER?qs=81r%252BiQLm7BROlYIxj7RTtQ%3D%3D; Arrow Part Number: BQ25306RTER; Arrow Price/Stock: https://www.arrow.com/en/products/bq25306rter/texas-instruments?region=nac
J26 = CMP-2000-05183-2: as J8 on sheet Power; Category: Conn; Digikey Description: PC TEST POINT MINIATURE; Automotive: No; Lead Free: Yes; Octopart: https://octopart.com/5015-keystone-3822; ComponentLink2URL: http://www.keyelco.com/product-pdf.cfm?p=1353; Package: 5015; RoHS: TRUE; Device Class L3: unset; Device Class L2: unset; Contact Material: Silver; Device Class L1: Connectors; Height: 1.65mm; ComponentLink2Description: Datasheet
J27 = CMP-02766-001743-1: CONN HEADER VERT 3POS 2.54MM; Max Voltage Rating (AC): 550V; Number of Positions: 3; Max Current Rating: 7.6A; Gender: Male; Termination: Solder; RoHS Compliant: Yes; Mount: Through Hole; Lead Free: Lead Free; Connector Type: Header; REACH SVHC: No SVHC; Insulation Color: Black; Width: 2.54mm; Length: 7.62mm; Flammability Rating: UL94 V-0; Housing Material: Polyester; Contact Material: Bronze; Max Operating Temperature: 125°C; Fastening Type: Pull; Series: TSW; Number of Contacts: 3; Packaging: Bulk; Min Operating Temperature: -55°C; Package Quantity: 1; Height: 10.67mm; Pitch: 2.54mm; Contact Finish - Mating: GOLD; Contact Type: Male Pin; Radiation Hardening: No; Color: Black; Housing Color: Black; Contact Plating: Gold; Orientation: Straight; Number of Rows: 1; Depth: 2.54mm; Insulation Material: PBT; Contact Mating Length: 0.32inch; Contact Shape: Square
L4 = 2.2uH: C177247; Manufacturer: cjiang(长江微电); Manufacturer Part: FXL0530-2R2-M; nameAlias: Value; Contributor: LCSC; Supplier: LCSC; Supplier Part: C177247; JLCPCB Part Class: Extended Part; spicePre: L; spiceSymbolName: FXL0530-2R2-M
LED7 = KT-0805G: C2296; Manufacturer_Name: Hubei KENTO Elec; Datasheet Link: https://jlcpcb.com/api/file/downloadByFileSystemAccessId/8639582106239348736; Height: 0.95mm; Manufacturer_Part_Number: KT-0805G
Q12 = CMP-2000-04931-2: C364310; Frequency: 300MHz; Power Dissipation: 350mW; Element Configuration: Single; Max Power Dissipation: 300mW; Collector Emitter Saturation Voltage: 300mV; Number of Elements: 1; hFE Min: 100; Collector Base Voltage (VCBO): 60V; Emitter Base Voltage (VEBO): 6V; Contact Plating: Tin; Package Quantity: 3000; Max Frequency: 300MHz; REACH SVHC: No SVHC; Max Operating Temperature: 150°C; Width: 1.4mm; Collector Emitter Voltage (VCEO): 40V; Voltage Rating (DC): 40V; Radiation Hardening: No; Case/Package: SOT-23; Height: 1mm; Collector Emitter Breakdown Voltage: 40V; Length: 3.05mm; Polarity: NPN; Packaging: Tape and Reel; Number of Pins: 3; Min Operating Temperature: -55°C; Gain Bandwidth Product: 300MHz; Mount: Surface Mount; Max Collector Current: 200mA; Weight: 0.000282oz; Continuous Collector Current: 200mA; Transition Frequency: 300MHz; Max Breakdown Voltage: 40V; Lead Free: Lead Free
Q13 Q14 = CMP-1058-00781-1: C20917; Manufacturer: On Semiconductor; PartNumber: 2N7002LT1G; Channel Polarity: N Channel; V(BR)DSS Min (V): 60; ID Max (A): 0.115; VGS Max (V): 20; Configuration: Single; VGS(th) Max (V): 2.5; Packing: Tape and Reel; ComponentLink1URL: http://www.onsemi.com/; ComponentLink3Description: Package Specification; ComponentLink3URL: http://www.onsemi.cn/pub_link/Collateral/318-08.PDF; PackageReference: SOT-23-3-318-08; RoHS: Pb-Free; ComponentLink2URL: http://www.onsemi.com/pub_link/Collateral/2N7002L-D.PDF; ComponentLink1Description: Manufacturer URL; Package Type: SOT-23-3; DatasheetVersion: Rev. 7; Mounting Technology: Surface Mount; ComponentLink2Description: Datasheet; PackageDescription: 3-Pin Small Outline Transistor, Body 2.92 x 1.3 mm, Pitch 0.95 mm; PackageVersion: Rev. AP, 11/2009
R55 R57 = CMP-26527-002093-1: C25104; Max Power Dissipation: 63mW; Tolerance: 5%; Resistance: 3.9R; Temperature Coefficient: 200ppm/°C; Case/Package: 0402; Number of Terminations: 2; Min Operating Temperature: -55°C; Height: 0.016inch; Packaging: Tape and Reel; Resistor Type: Thick Film; Length: 0.039inch; Mount: Surface Mount; Series: RMCF; Max Operating Temperature: 155°C; Contact Plating: Tin; Features: Automotive AEC-Q200; Width: 0.02inch; Radiation Hardening: No; RoHS Compliant: Yes
R56 = CMP-26527-002093-1: C25076; Max Power Dissipation: 63mW; Tolerance: 5%; Resistance: 3.9R; Temperature Coefficient: 200ppm/°C; Case/Package: 0402; Number of Terminations: 2; Min Operating Temperature: -55°C; Height: 0.016inch; Packaging: Tape and Reel; Resistor Type: Thick Film; Length: 0.039inch; Mount: Surface Mount; Series: RMCF; Max Operating Temperature: 155°C; Contact Plating: Tin; Features: Automotive AEC-Q200; Width: 0.02inch; Radiation Hardening: No; RoHS Compliant: Yes
R58 = CMP-26527-002093-1: as R36 on sheet Power; Case/Package: 0402; Number of Terminations: 2; Min Operating Temperature: -55°C; Height: 0.016inch; Packaging: Tape and Reel; Resistor Type: Thick Film; Length: 0.039inch; Mount: Surface Mount; Series: RMCF; Max Operating Temperature: 155°C; Contact Plating: Tin; Features: Automotive AEC-Q200; Width: 0.02inch; Radiation Hardening: No; RoHS Compliant: Yes
R59 R71 = CMP-26527-002093-1: as R21 on sheet Power; Case/Package: 0402; Number of Terminations: 2; Min Operating Temperature: -55°C; Height: 0.016inch; Packaging: Tape and Reel; Resistor Type: Thick Film; Length: 0.039inch; Mount: Surface Mount; Series: RMCF; Max Operating Temperature: 155°C; Contact Plating: Tin; Features: Automotive AEC-Q200; Width: 0.02inch; Radiation Hardening: No; RoHS Compliant: Yes
R60 = CMP-03412-043951-1: C22966; Power Rating: 100mW; Voltage Rating: 50V; Resistance: 3MR; Temperature Coefficient: 100ppm/°C; Tolerance: 1%; Number of Terminations: 2; Case Code (Metric): 1608; Resistor Type: Thick Film; Termination: SMD/SMT; Case/Package: 0603; RoHS Compliant: Yes; Features: Moisture Resistant; Max Power Dissipation: 100mW; Case Code (Imperial): 0603; Max Operating Temperature: 155°C; Width: 0.8mm; Packaging: Tape and Reel; Length: 0.063inch; Min Operating Temperature: -55°C; Series: AC; Height: 0.022inch
R61 = CMP-26527-002093-1: C25082; Max Power Dissipation: 63mW; Tolerance: 5%; Resistance: 3.9R; Temperature Coefficient: 200ppm/°C; Case/Package: 0402; Number of Terminations: 2; Min Operating Temperature: -55°C; Height: 0.016inch; Packaging: Tape and Reel; Resistor Type: Thick Film; Length: 0.039inch; Mount: Surface Mount; Series: RMCF; Max Operating Temperature: 155°C; Contact Plating: Tin; Features: Automotive AEC-Q200; Width: 0.02inch; Radiation Hardening: No; RoHS Compliant: Yes
R62 = CMP-26527-002093-1: C25079; Max Power Dissipation: 63mW; Tolerance: 5%; Resistance: 3.9R; Temperature Coefficient: 200ppm/°C; Case/Package: 0402; Number of Terminations: 2; Min Operating Temperature: -55°C; Height: 0.016inch; Packaging: Tape and Reel; Resistor Type: Thick Film; Length: 0.039inch; Mount: Surface Mount; Series: RMCF; Max Operating Temperature: 155°C; Contact Plating: Tin; Features: Automotive AEC-Q200; Width: 0.02inch; Radiation Hardening: No; RoHS Compliant: Yes
R63 = CMP-04015-014497-1: C17477
R64 = CMP-26527-002093-1: C25765; Max Power Dissipation: 63mW; Tolerance: 5%; Resistance: 3.9R; Temperature Coefficient: 200ppm/°C; Case/Package: 0402; Number of Terminations: 2; Min Operating Temperature: -55°C; Height: 0.016inch; Packaging: Tape and Reel; Resistor Type: Thick Film; Length: 0.039inch; Mount: Surface Mount; Series: RMCF; Max Operating Temperature: 155°C; Contact Plating: Tin; Features: Automotive AEC-Q200; Width: 0.02inch; Radiation Hardening: No; RoHS Compliant: Yes
R65 = CMP-04015-014497-1: DNP 0805
R66 = CMP-26527-002093-1: C2974007; Max Power Dissipation: 63mW; Tolerance: 5%; Resistance: 3.9R; Temperature Coefficient: 200ppm/°C; Case/Package: 0402; Number of Terminations: 2; Min Operating Temperature: -55°C; Height: 0.016inch; Packaging: Tape and Reel; Resistor Type: Thick Film; Length: 0.039inch; Mount: Surface Mount; Series: RMCF; Max Operating Temperature: 155°C; Contact Plating: Tin; Features: Automotive AEC-Q200; Width: 0.02inch; Radiation Hardening: No; RoHS Compliant: Yes
R67 = CMP-26527-002093-1: C5713265; Max Power Dissipation: 63mW; Tolerance: 5%; Resistance: 3.9R; Temperature Coefficient: 200ppm/°C; Case/Package: 0402; Number of Terminations: 2; Min Operating Temperature: -55°C; Height: 0.016inch; Packaging: Tape and Reel; Resistor Type: Thick Film; Length: 0.039inch; Mount: Surface Mount; Series: RMCF; Max Operating Temperature: 155°C; Contact Plating: Tin; Features: Automotive AEC-Q200; Width: 0.02inch; Radiation Hardening: No; RoHS Compliant: Yes
R68 = CMP-03412-049911-1: C25879; Resistance: 4.3kR; Max Power Dissipation: 63mW; Temperature Coefficient: 100ppm/°C; Tolerance: 5%; Case/Package: 0402; Height: 0.015inch; Width: 0.02inch; Min Operating Temperature: -55°C; Packaging: Tape and Reel; Max Operating Temperature: 155°C; Features: Moisture Resistant; Series: AF; Number of Terminations: 2; Length: 0.039inch; Resistor Type: Thick Film; RoHS Compliant: Yes
R69 = CMP-06022-000215-2: C178739
R70 = CMP-26527-002093-1: as R26 on sheet Power; Case/Package: 0402; Number of Terminations: 2; Min Operating Temperature: -55°C; Height: 0.016inch; Packaging: Tape and Reel; Resistor Type: Thick Film; Length: 0.039inch; Mount: Surface Mount; Series: RMCF; Max Operating Temperature: 155°C; Contact Plating: Tin; Features: Automotive AEC-Q200; Width: 0.02inch; Radiation Hardening: No; RoHS Compliant: Yes
R72 = CMP-26527-002093-1: C226807; Max Power Dissipation: 63mW; Tolerance: 5%; Resistance: 3.9R; Temperature Coefficient: 200ppm/°C; Case/Package: 0402; Number of Terminations: 2; Min Operating Temperature: -55°C; Height: 0.016inch; Packaging: Tape and Reel; Resistor Type: Thick Film; Length: 0.039inch; Mount: Surface Mount; Series: RMCF; Max Operating Temperature: 155°C; Contact Plating: Tin; Features: Automotive AEC-Q200; Width: 0.02inch; Radiation Hardening: No; RoHS Compliant: Yes
R73 = CMP-26527-002093-1: C2986585; Max Power Dissipation: 63mW; Tolerance: 5%; Resistance: 3.9R; Temperature Coefficient: 200ppm/°C; Case/Package: 0402; Number of Terminations: 2; Min Operating Temperature: -55°C; Height: 0.016inch; Packaging: Tape and Reel; Resistor Type: Thick Film; Length: 0.039inch; Mount: Surface Mount; Series: RMCF; Max Operating Temperature: 155°C; Contact Plating: Tin; Features: Automotive AEC-Q200; Width: 0.02inch; Radiation Hardening: No; RoHS Compliant: Yes
U1 = BQ29209DRBR: C139352; MF: Texas Instruments; SnapEDA_Link: https://www.snapeda.com/parts/BQ29209DRBR/Texas+Instruments/view-part/?ref=snap; Package: VSON-8 Texas Instruments; Value: *; MP: BQ29209DRBR; Check_prices: https://www.snapeda.com/parts/BQ29209DRBR/Texas+Instruments/view-part/?ref=eda